# EAGLE schematic USB_Boost (EAGLE 6.5.0)

## Sheet 1 of 2
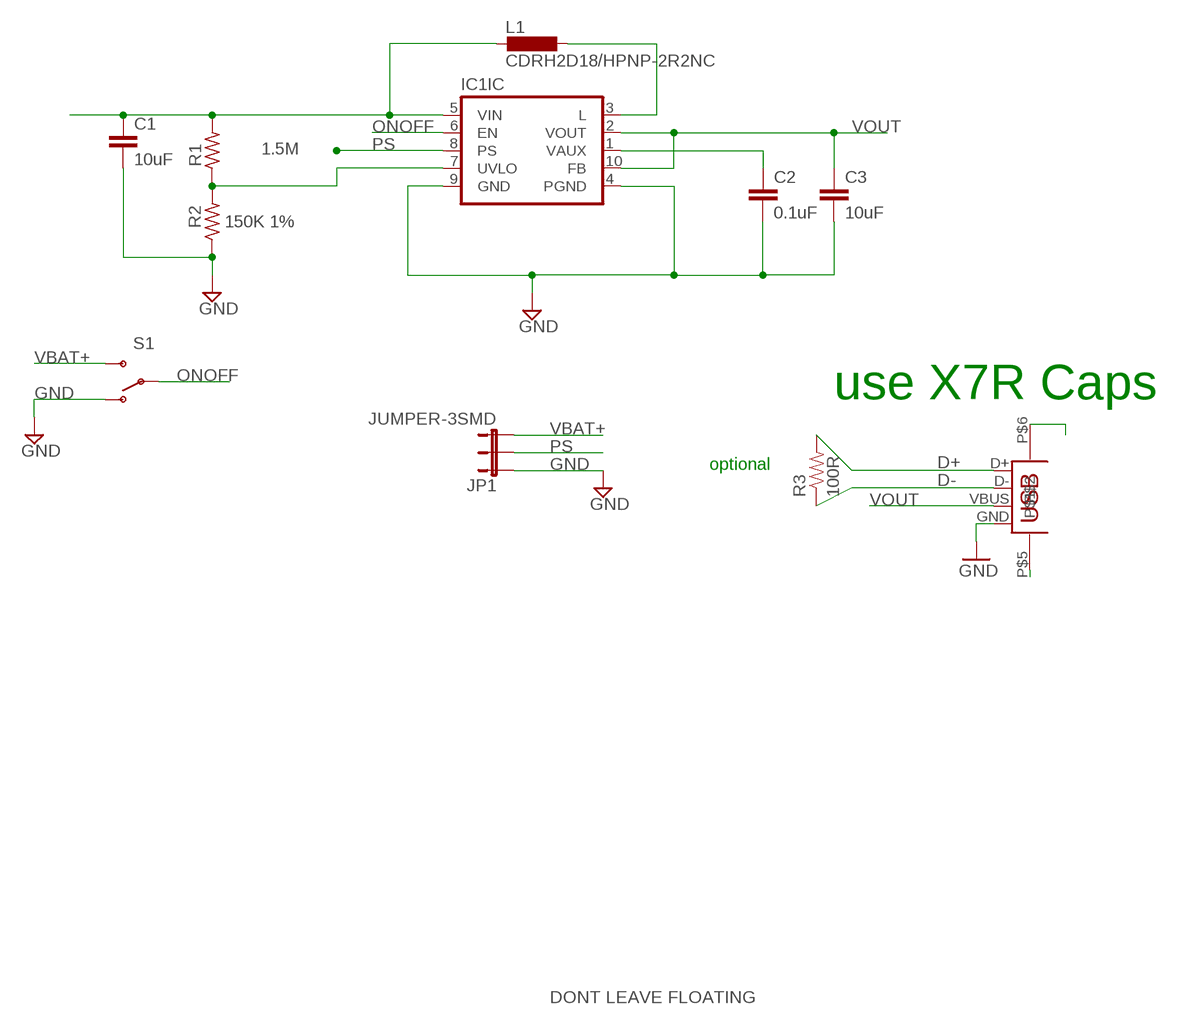
[diagram p0: schematic, sheet 1]

### Parts
C1  10uF  SPARKFUN_CAP0603-CAP  [SPARKFUN_0603-CAP]
C2  0.1uF  SPARKFUN_CAP0603-CAP  [SPARKFUN_0603-CAP]
C3  10uF  SPARKFUN_CAP0603-CAP  [SPARKFUN_0603-CAP]
IC1  IC_TPS6120XQFN10  [QFN-10]
JP1  JUMPER-3SMD  [SJ_3]
L1  CDRH2D18/HPNP-2R2NC  CDRH2D18  [CDRH2D18]
R1  1.5M  RESISTORRLC_0603  [RLC_0603]
R2  150K 1%  RESISTORRLC_0603  [RLC_0603]
R3  100R  RESISTOR0805-RES  [0805]
S1  SWITCH-SPDT-SMD-A  [SWITCH-SPST-SMD-A]
X1  USBKUSBX-SMT-AS1N  [KSUBX-SMT-AS1N]

### Nets
D+: R3.2 X1.D+
D-: R3.1 X1.D-
GND: C1.2 C2.2 C3.2 IC1.4(IC:PGND) IC1.9(IC:GND) JP1.1 R2.1 S1.1(O) X1.GND ; also sheet 2
GNDUSB: X1.P$5 X1.P$6
N$66: C2.1 IC1.1(IC:VAUX)
N$67: IC1.7(IC:UVLO) R1.1 R2.2
N$68: IC1.3(IC:L) L1.P$2
ONOFF: IC1.6(IC:EN) S1.2(P)
PS: IC1.8(IC:PS) JP1.2
VBAT+ [power]: C1.1 IC1.5(IC:VIN) JP1.3 L1.P$1 R1.2 S1.3(S)
VOUT: C3.1 IC1.2(IC:VOUT) IC1.10(IC:FB) X1.VBUS

### Notes on the sheet
- use X7R Caps
- optional
- DONT LEAVE FLOATING

## Sheet 2 of 2
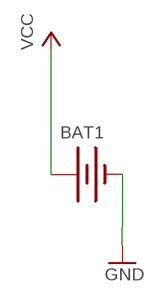
[diagram p1: schematic, sheet 2]

### Parts
BAT1  BATTERYCR123A  [BATTERY_CR123A]

### Nets
GND: BAT1.- ; also sheet 1
VCC: BAT1.+

## Power pins joined to a net without a drawn wire
GND: IC1.P0(GND:GND) IC1.P1(GND:GND) IC1.P2(GND:GND) IC1.P3(GND:GND) IC1.P4(GND:GND) IC1.V0(GND:GND) IC1.V1(GND:GND)

## Library data of the parts
BAT1 = tvbgone-adj:BATTERY: Battery Holders Various common sizes : AA, AAA, 20mm coin cell and 12mm coin cell.
C1 C3 = STM32-PROX:SPARKFUN_CAP: Capacitor Standard 0603 ceramic capacitor, and 0.1" leaded capacitor.; OC_NEWARK: unknown; PARTNO: *
C2 = STM32-PROX:SPARKFUN_CAP: Capacitor Standard 0603 ceramic capacitor, and 0.1" leaded capacitor.; MPN: 02016D104KAT2A; OC_NEWARK: 85K9474; PARTNO: 02016D104KAT2A
IC1 = STM32-PROX:IC_TPS6120X: Low input voltage Synchronous Boost converter; OC_NEWARK: unknown; PARTNO: TPS61202DRCT
JP1 = STM32-PROX:JUMPER-3; OC_NEWARK: unknown; PARTNO: *
L1 = STM32-PROX:CDRH2D18; OC_NEWARK: unknown; PARTNO: *
R1 = STM32-PROX:RESISTOR; OC_NEWARK: unknown; PARTNO: *; TOLERANCE: 5%
R2 = STM32-PROX:RESISTOR; OC_NEWARK: unknown; PARTNO: *; TOLERANCE: 1%
R3 = SparkFun:RESISTOR: Resistor Basic schematic elements and footprints for 0603, 1206, and PTH resistors.
S1 = STM32-PROX:SWITCH-SPDT: SPDT Switch Simple slide switch, Spark Fun Electronics SKU : COM-00102 DPDT SMT slide switch, AYZ0202, SWCH-08179; OC_NEWARK: unknown; PARTNO: *
X1 = USB_Boost:USB: USB Connectors USB-B-PTH is fully proven SKU : PRT-00139 USB-miniB is fully proven SKU : PRT-00587 USB-A-PCB is untested. USB-A-H is throughly reviewed, but untested. Spark Fun Electronics SKU : PRT-00437 USB-B-SMT is throughly reviewed, but untested. Needs silkscreen touching up. USB-A-S has not been used/tested USB-MB-H has not been used/tested

## Net classes
0 default: width 0.203 mm
2 power: width 0.356 mm, drill 0.254 mm, clearance 0.203 mm